# EAGLE design Medir-220 (EAGLE 7.2.0)
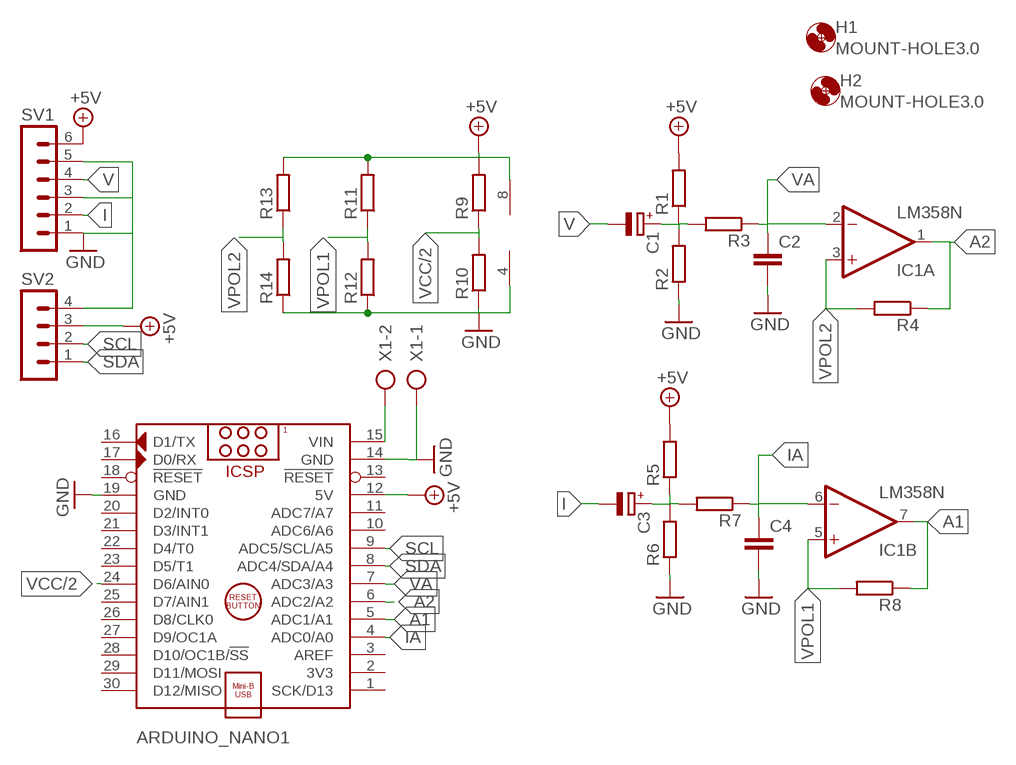
[diagram p0: schematic, sheet 1]

## Parts
ARDUINO_NANO1  ARDUINO_NANO  [ARDUINO_NANO]
C1  CPOL-EUE2.5-5  [E2,5-5]
C2  C-EU050-025X075  [C050-025X075]
C3  CPOL-EUE2.5-5  [E2,5-5]
C4  C-EU050-025X075  [C050-025X075]
H1  MOUNT-HOLE3.0  [3,0]
H2  MOUNT-HOLE3.0  [3,0]
IC1  LM358N  [DIL08]
R1  R-EU_0207/7  [0207/7]
R2  R-EU_0207/7  [0207/7]
R3  R-EU_0207/7  [0207/7]
R4  R-EU_0207/7  [0207/7]
R5  R-EU_0207/7  [0207/7]
R6  R-EU_0207/7  [0207/7]
R7  R-EU_0207/7  [0207/7]
R8  R-EU_0207/7  [0207/7]
R9  R-EU_0207/10  [0207/10]
R10  R-EU_0207/10  [0207/10]
R11  R-EU_0207/7  [0207/7]
R12  R-EU_0207/7  [0207/7]
R13  R-EU_0207/7  [0207/7]
R14  R-EU_0207/7  [0207/7]
SV1  MA06-1  [MA06-1]
SV2  MA04-1  [MA04-1]
X1  AK500/2  [AK500/2]

## Nets
+5V: ARDUINO_NANO1.12(5V) IC1.8(P:V+) R1.2 R5.2 R9.2 R11.2 R13.2 SV1.6 SV2.3
A1: ARDUINO_NANO1.5(ADC1/A1) IC1.7(B:OUT) R8.1
A2: ARDUINO_NANO1.6(ADC2/A2) IC1.1(A:OUT) R4.1
GND: ARDUINO_NANO1.14(GND) ARDUINO_NANO1.19(GND) C2.2 C4.2 IC1.4(P:V-) R2.1 R6.1 R10.1 R12.1 R14.1 SV1.1 SV1.3 SV1.5 SV2.4 X1.1
I: C3.- SV1.2
IA: ARDUINO_NANO1.4(ADC0/A0) C4.1 IC1.6(B:-IN) R7.1
N$1: C1.+ R1.1 R2.2 R3.2
N$2: C3.+ R5.1 R6.2 R7.2
N$3: ARDUINO_NANO1.15(VIN) X1.2
SCL: ARDUINO_NANO1.9(ADC5/SCL/A5) SV2.2
SDA: ARDUINO_NANO1.8(ADC4/SDA/A4) SV2.1
V: C1.- SV1.4
VA: ARDUINO_NANO1.7(ADC3/A3) C2.1 IC1.2(A:-IN) R3.1
VCC/2: ARDUINO_NANO1.24(D6/AIN0) R9.1 R10.2
VPOL1: IC1.5(B:+IN) R8.2 R11.1 R12.2
VPOL2: IC1.3(A:+IN) R4.2 R13.1 R14.2
Unconnected: ARDUINO_NANO1.1(SCK/D13) ARDUINO_NANO1.2(3V3) ARDUINO_NANO1.3(AREF) ARDUINO_NANO1.10(ADC6/A6) ARDUINO_NANO1.11(ADC7/A7) ARDUINO_NANO1.13(!RESET) ARDUINO_NANO1.16(D1/TX) ARDUINO_NANO1.17(D0/RX) ARDUINO_NANO1.18(!RESET) ARDUINO_NANO1.20(D2/INT0) ARDUINO_NANO1.21(D3/INT1) ARDUINO_NANO1.22(D4/T0) ARDUINO_NANO1.23(D5/T1) ARDUINO_NANO1.25(D7/AIN1) ARDUINO_NANO1.26(D8/CLK0) ARDUINO_NANO1.27(D9/OC1A) ARDUINO_NANO1.28(D10/OC1B/!SS) ARDUINO_NANO1.29(D11/MOSI) ARDUINO_NANO1.30(D12/MISO)

## Library data of the parts
ARDUINO_NANO1 = ArduinoNanoV30:ARDUINO_NANO: Arduino Nano V3.0 Module Overview: The Arduino Nano is a small, complete, and breadboard-friendly board based on the ATmega328 (Arduino Nano 3.x) or ATmega168 (Arduino Nano 2.x). It has more or less the same functionality of the Arduino Duemilanove, but in a different package. It lacks only a DC power jack, and works with a Mini-B USB cable instead of a standard one. The Nano was designed and is being produced by Gravitech <http://www.gravitech.us/arna30wiatp.html>. General specifications: Item Value Microcontroller Atmel ATmega168 or ATmega328 Operating Voltage (logic level) 5 V Input Voltage (recommended) 7-12 V Input Voltage (limits) 6-20 V Digital I/O Pins 14 (of which 6 provide PWM output) Analog Input Pins 8 DC Current per I/O Pin 40 mA Flash Memory 16 KB (ATmega168) or 32 KB (ATmega328) of which 2 KB used by bootloader SRAM 1 KB (ATmega168) or 2 KB (ATmega328) EEPROM 512 bytes (ATmega168) or 1 KB (ATmega328) Clock Speed 16 MHz Dimensions (Inches) 0.73" x 1.70" Dimensions (mm) 18mm x 45mm Overall height About 9 mm (not including pins) Weigth 5 g Power: The Arduino Nano can be powered via the Mini-B USB connection, 6-20V unregulated external power supply (pin 30), or 5V regulated external power supply (pin 27). The power source is automatically selected to the highest voltage source. Memory: The ATmega168 has 16 KB of flash memory for storing code (of which 2 KB is used for the bootloader); the ATmega328 has 32 KB, (also with 2 KB used for the bootloader). The ATmega168 has 1 KB of SRAM and 512 bytes of EEPROM (which can be read and written with the EEPROM library); the ATmega328 has 2 KB of SRAM and 1 KB of EEPROM. Input and Output: Each of the 14 digital pins on the Nano can be used as an input or output, using pinMode(), digitalWrite(), and digitalRead() functions. They operate at 5 volts. Each pin can provide or receive a maximum of 40 mA and has an internal pull-up resistor (disconnected by default) of 20-50 kOhms. In addition, some pins have specialized functions. Visit Arduino - ArduinoBoardNano <https://www.arduino.cc/en/Main/ArduinoBoardNano>
C1 C3 = rcl:CPOL-EU: POLARIZED CAPACITOR, European symbol
C2 C4 = rcl:C-EU: CAPACITOR, European symbol
H1 H2 = holes:MOUNT-HOLE: MOUNTING HOLE with drill center marker
IC1 = linear:LM358: OP AMP also LM158; LM258; LM2904 Source: http://cache.national.com/ds/LM/LM158.pdf
R1-R8 R11-R14 = resistor:R-EU_: RESISTOR, European symbol
R9 R10 = rcl:R-EU_: RESISTOR, European symbol
SV1 = con-lstb:MA06-1: PIN HEADER; OC_FARNELL: unknown; OC_NEWARK: unknown
SV2 = con-lstb:MA04-1: PIN HEADER; OC_FARNELL: unknown; OC_NEWARK: unknown
X1 = con-ptr500:AK500/2: CONNECTOR; OC_FARNELL: unknown; OC_NEWARK: unknown

## Board
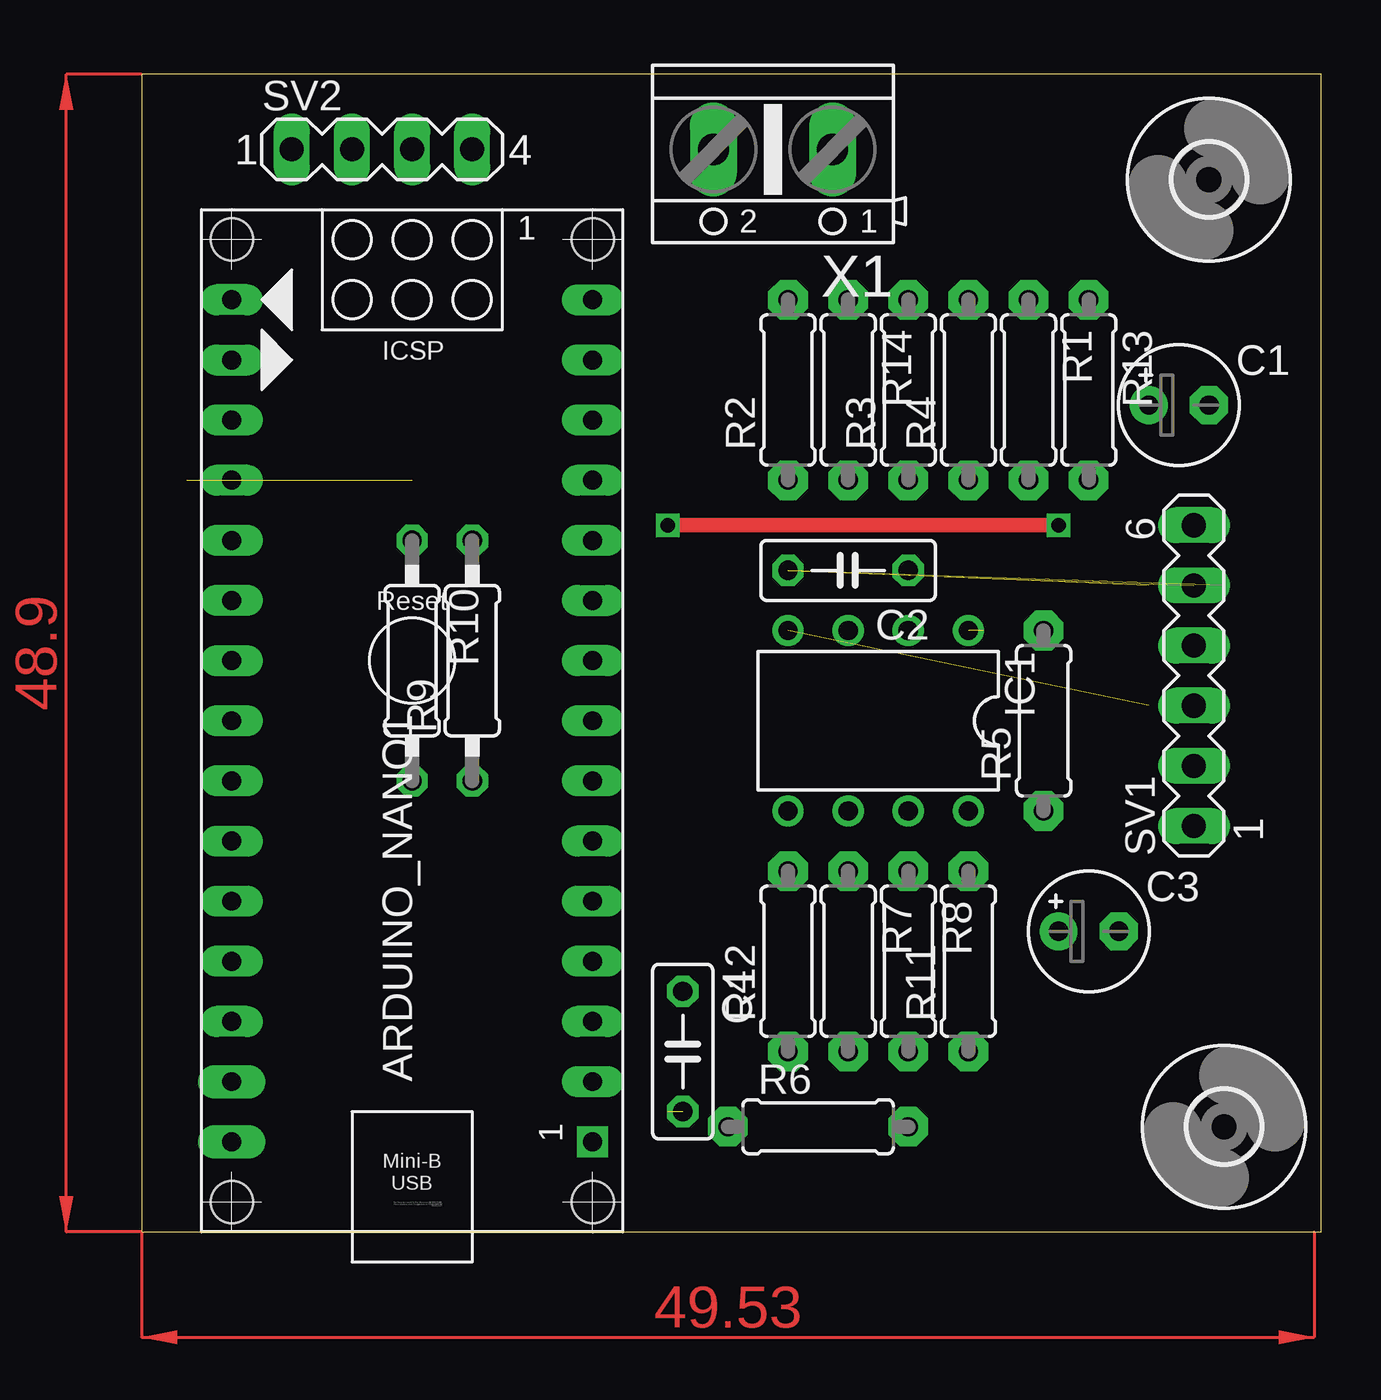
[diagram p1: board, top side]
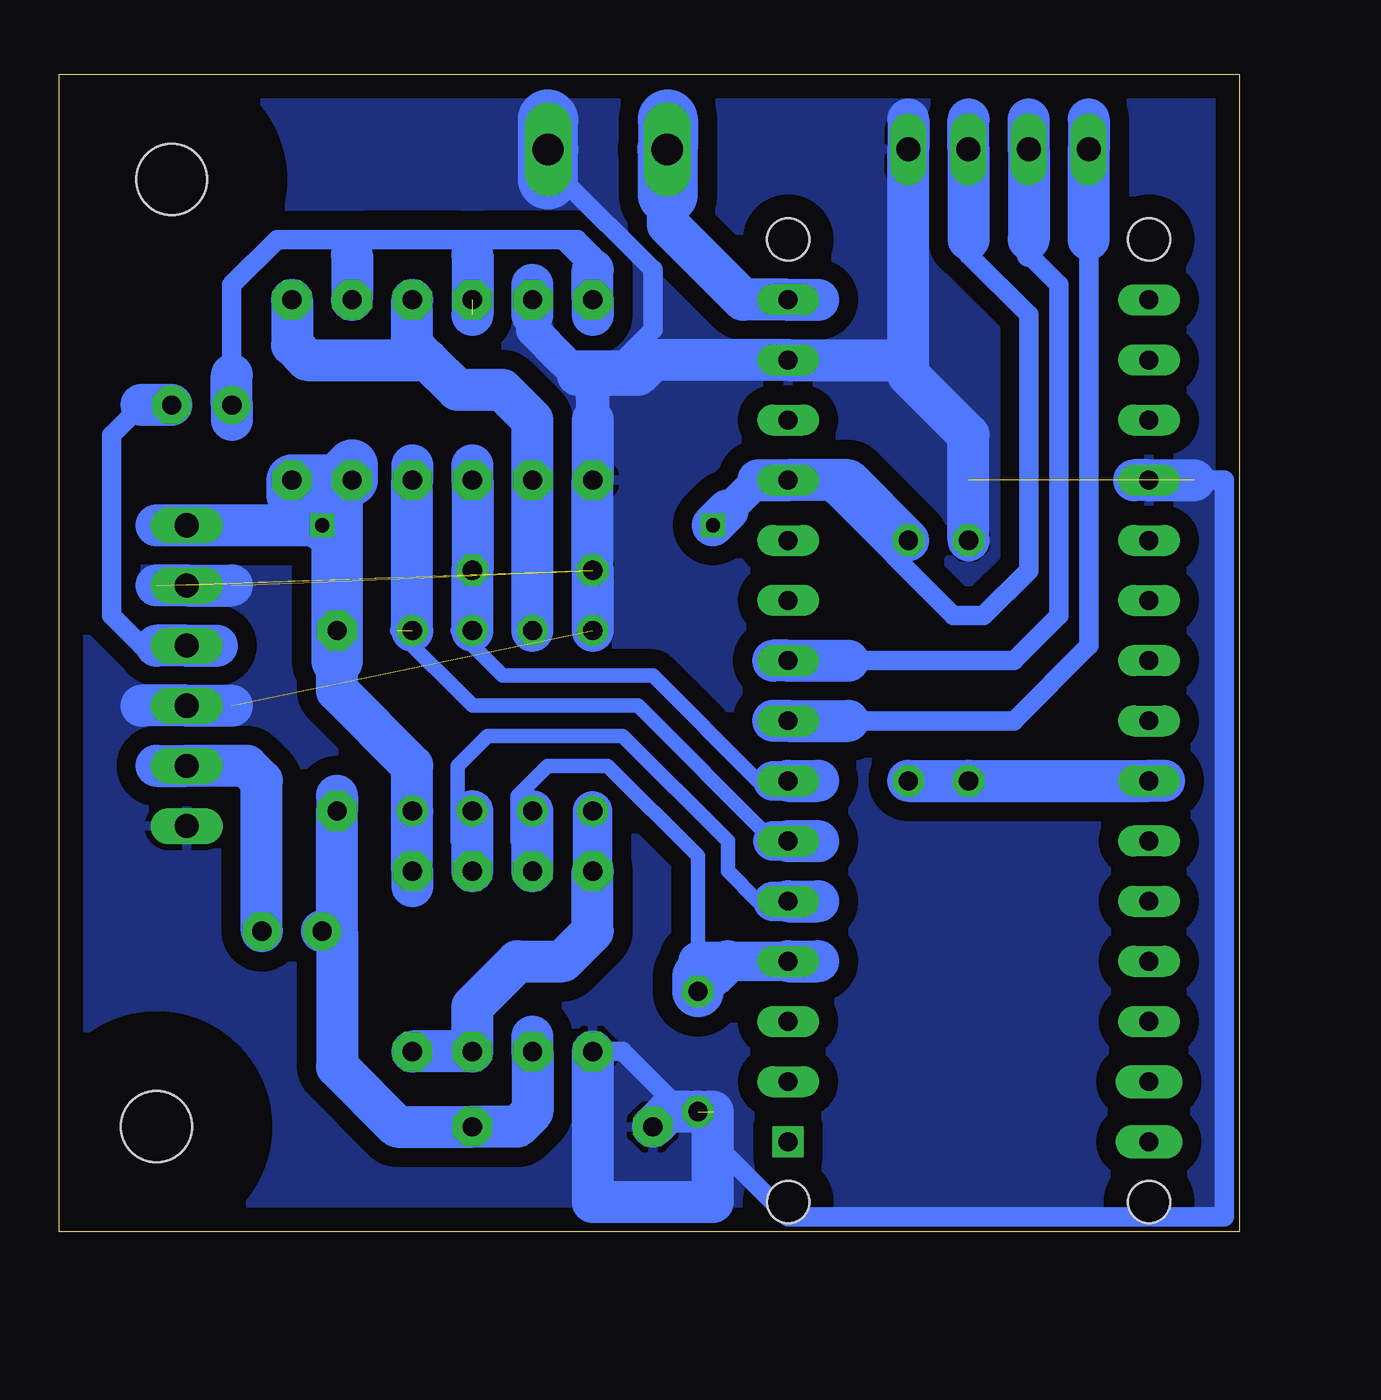
[diagram p2: board, bottom side, seen from below]

Size 49.84 x 48.88 mm. Coordinates in mm from the lower left corner, seen from the top.
Outline: 0,0 49.84,0 49.84,48.88 0,48.88 0,0
Copper layers (1*16): Top 0.035mm / dielectric 1.5mm / Bottom 0.035mm
Design rules "default": minimum track width 10mil, minimum drill 24mil, track to track 8mil, track to pad 8mil, pad to pad 8mil, via to via 8mil, smd to smd 8mil, copper to edge 40mil, drill to drill 8mil, minimum pad ring 10mil, minimum via ring 8mil, stop-mask expansion 4mil, vias tented up to drill 0mil, thermal gap 10mil

### Footprints (pad centres in the part's own frame; a part is rotated, then mirrored left to right if it is on the bottom)
ARDUINO_NANO = drill 0.8 pad 1.27 square: 1 -20.32,-7.62 | drill 0.8 long: 2 -17.78,-7.62; 3 -15.24,-7.62; 4 -12.7,-7.62; 5 -10.16,-7.62; 6 -7.62,-7.62; 7 -5.08,-7.62; 8 -2.54,-7.62; 9 0,-7.62; 10 2.54,-7.62; 11 5.08,-7.62; 12 7.62,-7.62; 13 10.16,-7.62; 14 12.7,-7.62; 15 15.24,-7.62; 16 15.24,7.62; 17 12.7,7.62; 18 10.16,7.62; 19 7.62,7.62; 20 5.08,7.62; 21 2.54,7.62; 22 0,7.62; 23 -2.54,7.62; 24 -5.08,7.62; 25 -7.62,7.62; 26 -10.16,7.62; 27 -12.7,7.62; 28 -15.24,7.62 | drill 0.8 pad 1.422 long: 29 -17.78,7.62; 30 -20.32,7.62 | hole 1.778: -22.86,-7.62; -22.86,7.62; 17.78,7.62; 17.78,-7.62
E2,5-5 = drill 0.813 pad 1.6: + -1.27,0 | drill 0.813 pad 1.6 octagon: - 1.27,0
C050-025X075 = drill 0.813 octagon: 1 -2.54,0; 2 2.54,0
3,0 = hole 3: 0,0
DIL08 = drill 0.813 pad 1.27: 1 -3.81,-3.81; 2 -1.27,-3.81; 3 1.27,-3.81; 4 3.81,-3.81; 5 3.81,3.81; 6 1.27,3.81; 7 -1.27,3.81; 8 -3.81,3.81
0207/7 = drill 0.813 pad 1.676 octagon: 1 -3.81,0; 2 3.81,0
0207/10 = drill 0.813 octagon: 1 -5.08,0; 2 5.08,0
MA06-1 = drill 1.016 long: 1 -6.35,0; 2 -3.81,0; 3 -1.27,0; 4 1.27,0; 5 3.81,0; 6 6.35,0
MA04-1 = drill 1.016 long: 1 -3.81,0; 2 -1.27,0; 3 1.27,0; 4 3.81,0
AK500/2 = drill 1.321 long: 1 -2.515,0; 2 2.515,0

### Placement (x,y rotation side)
ARDUINO_NANO1  11.43,24.13 90 top
C1  43.81,34.92 0 top
C2  29.84,27.94 180 top
C3  40.01,12.7 0 top
C4  22.86,7.62 270 top
H1  45.72,4.45 0 top
H2  45.09,44.45 0 top
IC1  31.11,21.59 180 top
R1  37.47,35.56 270 top
R2  27.3,35.56 90 top
R3  32.38,35.56 90 top
R4  34.92,35.56 90 top
R5  38.1,21.59 90 top
R6  28.57,4.45 0 top
R7  29.84,11.43 270 top
R8  32.38,11.43 270 top
R9  13.97,24.13 90 top
R10  11.43,24.13 270 top
R11  34.92,11.43 90 top
R12  27.3,11.43 90 top
R13  40.01,35.56 270 top
R14  29.84,35.56 270 top
SV1  44.45,23.5 90 top
SV2  10.16,45.72 0 top
X1  26.67,45.72 180 top

### Tracks (layer width: path | path; a pad name or v marks a point on that pad's centre or on a via)
+5V  (via drill 0.6)
  Top 0.61: v22.23,29.84 v38.73,29.84
  Bottom 0.813: 11.43,41.91 11.43,41.27 8.89,38.73 8.89,27.94 10.79,26.04 12.06,26.04 17.14,31.11 17.14,31.75
  Bottom 1.422: 20.32,31.75 21.59,30.48
  Bottom 1.778: 45.72,29.84 SV1.6 v38.73,29.84 | R9.2 16.51,31.75 17.14,31.75 ARDUINO_NANO1.12 20.32,31.75 | 34.92,14.61 R11.2 IC1.8 34.92,19.68 38.1,22.86 38.1,24.13 R5.2 | 11.43,46.99 SV2.3 11.43,41.91 | 21.59,30.48 v22.23,29.84
  Bottom 2.184: R1.2 37.47,32.38 38.1,31.75 | 38.1,24.13 38.1,31.75 | 38.1,31.75 R13.2 40.01,31.11 v38.73,29.84
A1
  Bottom 0.61: 32.38,15.88 33.02,16.51 33.02,19.68 31.75,20.95 26.04,20.95 21.59,16.51 21.59,15.24 20.32,13.97 19.68,13.97
  Bottom 1.676: ARDUINO_NANO1.5 19.68,13.97
  Bottom 1.778: R8.1 32.38,15.88 IC1.7 | ARDUINO_NANO1.5 17.78,13.97
A2  (1 unrouted)
  Bottom 0.61: 19.68,16.51 25.4,22.23 32.38,22.23 35.56,25.4
  Bottom 1.676: ARDUINO_NANO1.6 19.68,16.51
  Bottom 1.778: IC1.1 R4.1 34.92,32.38 | ARDUINO_NANO1.6 17.78,16.51
GND  (6 unrouted)
  Bottom 0.813: ARDUINO_NANO1.19 1.91,31.75 0.64,31.75 0.64,0.64 19.05,0.64 26.04,7.62 R12.1 | 29.21,44.45 28.57,44.45 24.77,40.64 24.77,38.1 26.04,36.83 28.57,36.83
  Bottom 1.422: 29.84,38.73 29.84,38.1 28.57,36.83 27.94,36.2 27.3,35.56 27.3,34.29
  Bottom 1.778: IC1.4 C2.2 R2.1 27.3,34.29 | R10.1 11.43,33.66 13.97,36.2 13.97,36.83 | 13.97,36.83 SV2.4 13.97,46.99 | 13.97,36.83 ARDUINO_NANO1.14 24.77,36.83 25.4,36.2 27.94,36.2 | 29.84,38.73 R14.1 29.84,40.01 | R12.1 27.3,1.27 22.23,1.27 22.23,5.08 24.13,5.08 R6.1 | 46.35,22.23 SV1.3 42.55,22.23 | 42.55,27.3 SV1.5 45.72,27.3 | 4.45,31.75 ARDUINO_NANO1.19 1.91,31.75
  Bottom 2.54: X1.1 29.18,46.97 29.21,46.99 29.21,44.45
  pour Bottom (isolate 0.813): 0,0 49.53,0 50.16,0 50.16,48.9 0,48.9
I
  Bottom 1.778: C3.- 41.27,19.05 41.91,19.68 SV1.2 45.72,19.68
IA
  Bottom 0.61: 22.86,11.43 22.86,15.88 26.67,19.68 29.21,19.68 30.48,18.41 30.48,16.51 29.84,15.88
  Bottom 1.676: ARDUINO_NANO1.4 21.59,11.43 22.86,11.43
  Bottom 1.778: R7.1 29.84,15.88 IC1.6 | ARDUINO_NANO1.4 17.78,11.43 | 22.86,10.79 22.23,10.79 21.59,11.43
  Bottom 2.184: C4.1 22.86,10.79
N$1  (1 unrouted)
  Bottom 0.813: 27.3,40.64 27.62,40.96 | 27.62,40.96 28.57,41.91 31.75,41.91 32.38,41.27 33.02,41.91 36.83,41.91 37.47,41.27 | 42.55,36.2 42.55,40.01 40.64,41.91 27.94,41.91 27.3,41.27 27.62,40.96
  Bottom 1.778: 27.3,38.73 R2.2 27.3,40.64 | 32.38,41.27 32.38,38.73 | 37.47,41.27 R1.1 | 42.55,34.29 C1.+ 42.55,36.2
N$2
  Bottom 1.778: C3.+ 38.1,12.7 | 38.1,12.7 R5.1 38.1,18.41 | 29.84,8.26 R7.2 29.84,5.08 30.48,4.45 R6.2 35.56,4.45 38.1,6.99 38.1,12.7
N$3
  Bottom 1.778: 17.78,39.37 ARDUINO_NANO1.15 20.95,39.37 24.13,42.55 24.13,43.81
  Bottom 2.54: 24.13,43.81 24.13,45.74 | 24.13,46.99 24.13,45.74 | 24.13,45.74 X1.2
SCL
  Bottom 0.813: 8.89,41.27 7.62,40.01 7.62,26.04 9.53,24.13 16.51,24.13
  Bottom 1.016: 8.89,41.91 8.89,41.27
  Bottom 1.778: 19.68,24.13 ARDUINO_NANO1.9 16.51,24.13 | 8.89,46.99 SV2.2 8.89,41.91
SDA
  Bottom 0.813: 6.35,41.91 6.35,24.77 9.53,21.59 16.51,21.59
  Bottom 1.778: 19.68,21.59 ARDUINO_NANO1.8 16.51,21.59 | 6.35,41.91 SV2.1 6.35,46.99
V
  Bottom 0.813: 45.72,24.77 46.35,24.77 47.62,26.04 47.62,33.66 46.35,34.92
  Bottom 1.778: 43.18,24.77 SV1.4 45.72,24.77 | C1.- 46.35,34.92
VA
  Bottom 0.61: 19.68,19.05 20.32,19.05 24.77,23.5 31.11,23.5 33.02,25.4 IC1.2
  Bottom 1.676: ARDUINO_NANO1.7 19.68,19.05
  Bottom 1.778: IC1.2 C2.1 R3.1 32.38,32.38 | ARDUINO_NANO1.7 17.78,19.05
VCC/2
  Bottom 1.778: R9.1 R10.2 ARDUINO_NANO1.24 3.17,19.05
VPOL1
  Bottom 1.676: R12.2 IC1.5
  Bottom 1.778: R11.1 R8.2 32.38,9.53 30.48,11.43 28.57,11.43 27.3,12.7 R12.2
VPOL2
  Bottom 1.778: IC1.3 R14.2 29.84,34.29 31.11,35.56 33.02,35.56 34.29,36.83 | 34.29,36.83 34.92,37.47 R4.2 | R13.1 40.01,37.47 39.37,36.83 34.29,36.83
(copper drawn outside any net)
  shapes: Top area x2